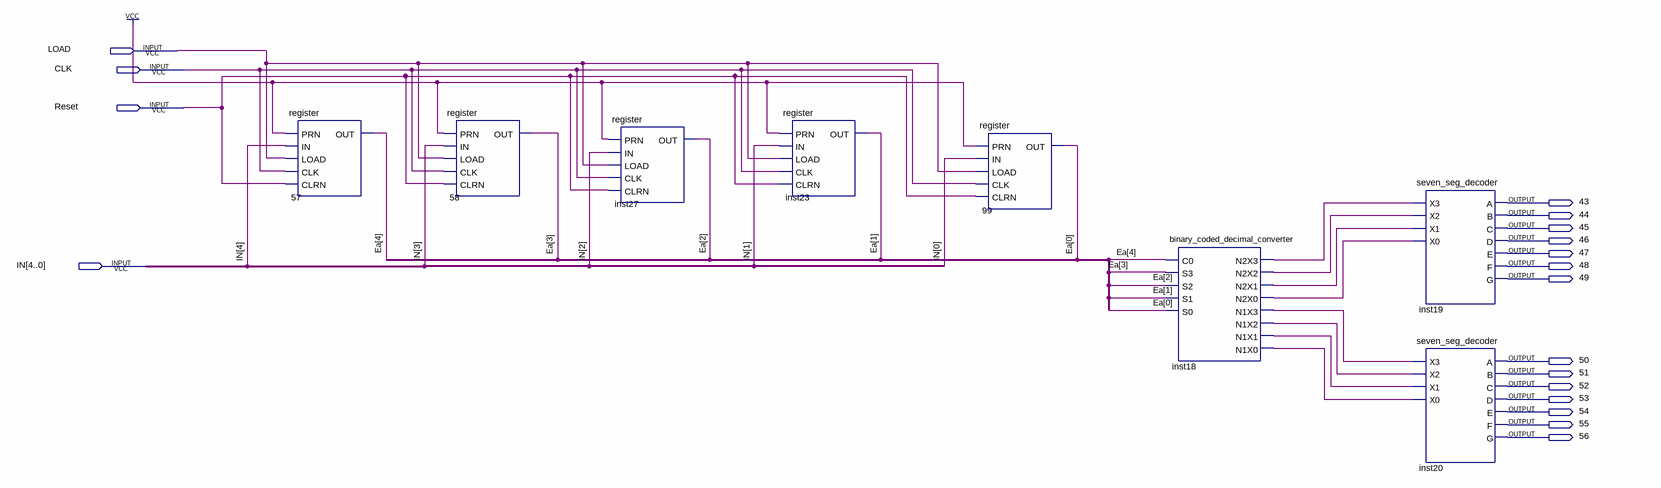
[diagram p0: schematic sheet]
// Quartus schematic moneyearntest.bdf as structural Verilog: 8 symbols, 18 pins
module moneyearntest (
  input  LOAD,
  input  CLK,
  input  Reset,
  input  [4:0] IN,
  output \43 ,
  output \44 ,
  output \45 ,
  output \46 ,
  output \47 ,
  output \48 ,
  output \49 ,
  output \50 ,
  output \51 ,
  output \52 ,
  output \53 ,
  output \54 ,
  output \55 ,
  output \56 
);

  wire inst18_n1x0, inst18_n1x1, inst18_n1x2, inst18_n1x3, inst18_n2x0, inst18_n2x1, inst18_n2x2, inst18_n2x3;
  wire [4:0] Ea;

  register u_57 (.PRN(1'b1), .IN(IN[4]), .LOAD(LOAD), .CLK(CLK), .CLRN(Reset), .OUT(Ea[4]));
  register u_58 (.PRN(1'b1), .IN(IN[3]), .LOAD(LOAD), .CLK(CLK), .CLRN(Reset), .OUT(Ea[3]));
  register inst27 (.PRN(1'b1), .IN(IN[2]), .LOAD(LOAD), .CLK(CLK), .CLRN(Reset), .OUT(Ea[2]));
  register inst23 (.PRN(1'b1), .IN(IN[1]), .LOAD(LOAD), .CLK(CLK), .CLRN(Reset), .OUT(Ea[1]));
  register u_99 (.PRN(1'b1), .IN(IN[0]), .LOAD(LOAD), .CLK(CLK), .CLRN(Reset), .OUT(Ea[0]));
  binary_coded_decimal_converter inst18 (
    .C0(Ea[4]), .S3(Ea[3]), .S2(Ea[2]), .S1(Ea[1]), .S0(Ea[0]), .N2X3(inst18_n2x3), .N2X2(inst18_n2x2),
    .N2X1(inst18_n2x1), .N2X0(inst18_n2x0), .N1X3(inst18_n1x3), .N1X2(inst18_n1x2), .N1X1(inst18_n1x1),
    .N1X0(inst18_n1x0));
  seven_seg_decoder inst19 (
    .X3(inst18_n2x3), .X2(inst18_n2x2), .X1(inst18_n2x1), .X0(inst18_n2x0), .A(\43 ), .B(\44 ), .C(\45 ),
    .D(\46 ), .E(\47 ), .F(\48 ), .G(\49 ));
  seven_seg_decoder inst20 (
    .X3(inst18_n1x3), .X2(inst18_n1x2), .X1(inst18_n1x1), .X0(inst18_n1x0), .A(\50 ), .B(\51 ), .C(\52 ),
    .D(\53 ), .E(\54 ), .F(\55 ), .G(\56 ));
endmodule
